# Altium schematic sheet MCU.SchDoc
size A3; CompanyName: Ok's Lab; Engineer: Oktay Topcu; SheetNumber: 3; SheetTotal: 7; UniqueID: 20200803; X2: A3; X3: 20200803; X4: r1.0; X6: 3; X7: 7; X8: MCU.SchDoc
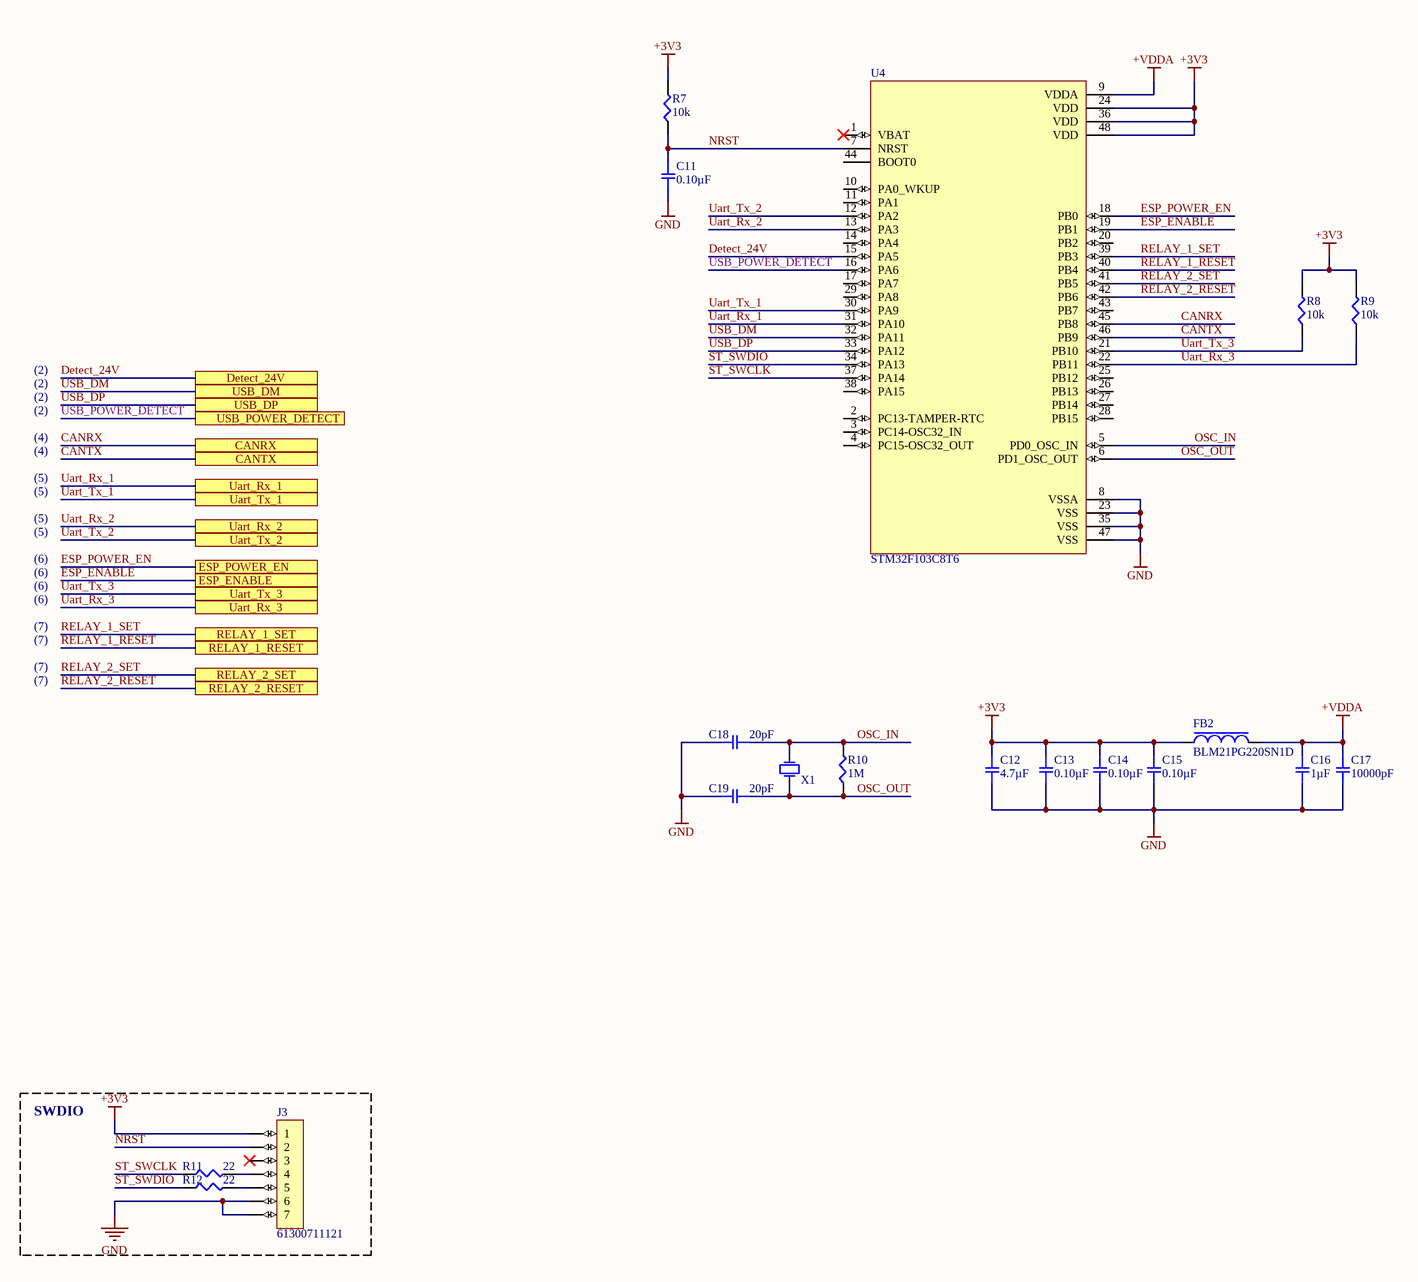
[diagram p0: MCU.SchDoc]

## Parts
C11  0.10µF  [SMD-0603C]
C12  4.7µF  [SMD-0805C]
C13  0.10µF  [SMD-0603C]
C14  0.10µF  [SMD-0603C]
C15  0.10µF  [SMD-0603C]
C16  1µF  [SMD-0603C]
C17  10000pF  [SMD-0603C]
C18  20pF  [SMD-0603C]
C19  20pF  [SMD-0603C]
FB2  BLM21PG220SN1D  [L-0805]
J3  61300711121  [HEADER_7__61300711121]
R7  10k  [SMD-0603-RES]
R8  10k  [SMD-0603-RES]
R9  10k  [SMD-0603-RES]
R10  1M  [SMD-0603-RES]
R11  22  [SMD-0603-RES]
R12  22  [SMD-0603-RES]
U4  STM32F103C8T6  [QFN48-(7mmX7mm)]
X1  EB3250AYA08-8.000M TR  [XTAL_3.2mm_1.5mm_2pad]  (value not drawn)

## Blocks framed on the sheet
SWDIO: J3 R11 R12

## Ports
CANRX, CANTX, Detect_24V, ESP_ENABLE, ESP_POWER_EN, RELAY_1_RESET, RELAY_1_SET, RELAY_2_RESET, RELAY_2_SET, Uart_Rx_1, Uart_Rx_2, Uart_Rx_3, Uart_Tx_1, Uart_Tx_2, Uart_Tx_3, USB_DM, USB_DP, USB_POWER_DETECT

## Nets
+3V3: C12.1 C13.1 C14.1 C15.1 FB2.1 J3.1 R7.2 R8.2 R9.2 U4.24(VDD) U4.36(VDD) U4.48(VDD)
+VDDA: C16.1 C17.1 FB2.2 U4.9(VDDA)
GND: C11.2 C12.2 C13.2 C14.2 C15.2 C16.2 C17.2 C18.2 C19.2 J3.6 J3.7 U4.8(VSSA) U4.23(VSS) U4.35(VSS) U4.47(VSS)
CANRX: U4.45(PB8) ; port CANRX
CANTX: U4.46(PB9) ; port CANTX
Detect_24V: U4.15(PA5) ; port Detect_24V
ESP_ENABLE: U4.19(PB1) ; port ESP_ENABLE
ESP_POWER_EN: U4.18(PB0) ; port ESP_POWER_EN
NRST: C11.1 J3.2 R7.1 U4.7(NRST)
OSC_IN: C18.1 R10.2 U4.5(PD0_OSC_IN) X1.2(OSC2)
OSC_OUT: C19.1 R10.1 U4.6(PD1_OSC_OUT) X1.1(OSC1)
RELAY_1_RESET: U4.40(PB4) ; port RELAY_1_RESET
RELAY_1_SET: U4.39(PB3) ; port RELAY_1_SET
RELAY_2_RESET: U4.42(PB6) ; port RELAY_2_RESET
RELAY_2_SET: U4.41(PB5) ; port RELAY_2_SET
ST_SWCLK: R11.1 U4.37(PA14)
ST_SWDIO: R12.1 U4.34(PA13)
Uart_Rx_1: U4.31(PA10) ; port Uart_Rx_1
Uart_Rx_2: U4.13(PA3) ; port Uart_Rx_2
Uart_Rx_3: R9.1 U4.22(PB11) ; port Uart_Rx_3
Uart_Tx_1: U4.30(PA9) ; port Uart_Tx_1
Uart_Tx_2: U4.12(PA2) ; port Uart_Tx_2
Uart_Tx_3: R8.1 U4.21(PB10) ; port Uart_Tx_3
USB_DM: U4.32(PA11) ; port USB_DM
USB_DP: U4.33(PA12) ; port USB_DP
USB_POWER_DETECT: U4.16(PA6) ; port USB_POWER_DETECT
NetJ3_4: J3.4 R11.2
NetJ3_5: J3.5 R12.2

Not connected (* = marked no-connect by the designer): J3 3*; U4 1(VBAT)* 2(PC13-TAMPER-RTC) 3(PC14-OSC32_IN) 4(PC15-OSC32_OUT) 10(PA0_WKUP) 11(PA1) 14(PA4) 17(PA7) 20(PB2) 25(PB12) 26(PB13) 27(PB14) 28(PB15) 29(PA8) 38(PA15) 43(PB7) 44(BOOT0)

## Notes on the sheet
- (2)
- (4)
- (5)
- (6)
- (7)
- Title
- Size:
- Date:
- Number:
- Revision:
- Sheet
- of
- File:

## Library data of the parts
C11 C13-C15 = GCJ188R71H104KA12D: CAP CER 0.1UF 50V X7R 0603; Manufacturer: Murata Electronics North America; Factory Stock: 0; Unit Price (USD): 0.12; Minimum Quantity: 1; Tolerance: ±10%; Datasheets: http://www.murata.com/~/media/webrenewal/support/library/catalog/products/capacitor/mlcc/c03e.ashx; Image: //media.digikey.com/Renders/Murata%20Renders/0603%28LQG18%29.jpg; Digi-Key Part Number: 490-5798-1-ND; Part Number: GCJ188R71H104KA12D; Quantity Available: 163695; @ qty: 0; Packaging: Cut Tape (CT); Series: GCJ; Part Status: Active; Value: 0.10µF; Voltage: 50V; Temperature Coefficient: X7R; Operating Temperature: -55°C ~ 125°C; Features: Soft Termination; Ratings: AEC-Q200; Applications: Automotive, Boardflex Sensitive; Mounting Type: Surface Mount, MLCC; Package / Case: 0603 (1608 Metric); Size / Dimension: 0.063" L x 0.031" W (1.60mm x 0.80mm); Height - Seated (Max): -; Thickness (Max): 0.035" (0.90mm); Lead Spacing: -; Lead Style: -
C12 = GCJ21BR71C475KA01L: CAP CER 4.7UF 16V X7R 0805; Manufacturer: Murata Electronics North America; Factory Stock: 0; Unit Price (USD): 0.44; Minimum Quantity: 1; Tolerance: ±10%; Datasheets: http://www.murata.com/~/media/webrenewal/support/library/catalog/products/capacitor/mlcc/c03e.ashx; Image: //media.digikey.com/Renders/Murata%20Renders/0805%20(2012%20Metric)%20.85mm.jpg; Digi-Key Part Number: 490-10557-1-ND; Part Number: GCJ21BR71C475KA01L; Quantity Available: 53217; @ qty: 0; Packaging: Cut Tape (CT); Series: GCJ; Part Status: Active; Value: 4.7µF; Voltage: 16V; Temperature Coefficient: X7R; Operating Temperature: -55°C ~ 125°C; Features: Soft Termination; Ratings: AEC-Q200; Applications: Automotive, Boardflex Sensitive; Mounting Type: Surface Mount, MLCC; Package / Case: 0805 (2012 Metric); Size / Dimension: 0.079" L x 0.049" W (2.00mm x 1.25mm); Height - Seated (Max): -; Thickness (Max): 0.057" (1.45mm); Lead Spacing: -; Lead Style: -
C16 = GCM188R71C105KA64D: CAP CER 1UF 16V X7R 0603; Manufacturer: Murata Electronics North America; Factory Stock: 0; Unit Price (USD): 0.24; Minimum Quantity: 1; Tolerance: ±10%; Datasheets: http://www.murata.com/~/media/webrenewal/support/library/catalog/products/capacitor/mlcc/c03e.ashx; Image: //media.digikey.com/Renders/Murata%20Renders/0603%28GCM188%29.jpg; Digi-Key Part Number: 490-5241-1-ND; Part Number: GCM188R71C105KA64D; Quantity Available: 9243; @ qty: 0; Packaging: Cut Tape (CT); Series: GCM; Part Status: Active; Value: 1µF; Voltage: 16V; Temperature Coefficient: X7R; Operating Temperature: -55°C ~ 125°C; Features: -; Ratings: AEC-Q200; Applications: Automotive; Mounting Type: Surface Mount, MLCC; Package / Case: 0603 (1608 Metric); Size / Dimension: 0.063" L x 0.031" W (1.60mm x 0.80mm); Height - Seated (Max): -; Thickness (Max): 0.035" (0.90mm); Lead Spacing: -; Lead Style: -
C17 = GRM188R71C103KA01D: CAP CER 10000PF 16V X7R 0603; Manufacturer: Murata Electronics North America; Factory Stock: 0; Unit Price (USD): 0.1; Minimum Quantity: 1; Tolerance: ±10%; Datasheets: http://www.murata.com/~/media/webrenewal/support/library/catalog/products/capacitor/mlcc/c02e.pdf; Image: //media.digikey.com/Renders/Murata%20Renders/ZRB-SERIES-0402.jpg; Digi-Key Part Number: 490-1525-1-ND; Part Number: GRM188R71C103KA01D; Quantity Available: 178769; @ qty: 0; Packaging: Cut Tape (CT); Series: GRM; Part Status: Active; Value: 10000pF; Voltage: 16V; Temperature Coefficient: X7R; Operating Temperature: -55°C ~ 125°C; Features: -; Ratings: -; Applications: General Purpose; Mounting Type: Surface Mount, MLCC; Package / Case: 0603 (1608 Metric); Size / Dimension: 0.063" L x 0.031" W (1.60mm x 0.80mm); Height - Seated (Max): -; Thickness (Max): 0.035" (0.90mm); Lead Spacing: -; Lead Style: -
C18 C19 = GCM1885C1H200JA16D: CAP CER 20PF 50V NP0 0603; Manufacturer: Murata Electronics North America; Factory Stock: 0; Unit Price (USD): 0.11; Minimum Quantity: 1; Tolerance: ±5%; Temperature Coefficient: C0G, NP0; Datasheets: http://www.murata.com/~/media/webrenewal/support/library/catalog/products/capacitor/mlcc/c03e.ashx; Image: //media.digikey.com/Renders/Murata%20Renders/0603%28GCM188%29.jpg; Digi-Key Part Number: 490-13299-1-ND; Part Number: GCM1885C1H200JA16D; Quantity Available: 4211; @ qty: 0; Packaging: Cut Tape (CT); Series: GCM; Part Status: Active; Value: 20pF; Voltage: 50V; Operating Temperature: -55°C ~ 125°C; Features: -; Ratings: AEC-Q200; Applications: Automotive; Mounting Type: Surface Mount, MLCC; Package / Case: 0603 (1608 Metric); Size / Dimension: 0.063" L x 0.031" W (1.60mm x 0.80mm); Height - Seated (Max): -; Thickness (Max): 0.035" (0.90mm); Lead Spacing: -; Lead Style: -
FB2 = Ferrite_Bead__BLM21PG220SN1D: FERRITE BEAD 22 OHM 0805 1LN; Manufacturer: Murata; Manufacturer Series: BLM21P; Material: Steel,Ferrite; Impedance: 22R; DC Resistance (DCR): 9mR; Tolerance: 25%; Current Rating: 6A; Shielding: Unshielded; Number of Circuits: 1; Resistance: 10mR; Test Frequency: 100MHz; Supplier 1: Avnet; Manufacturer Part Number: BLM21PG220SN1D; Stock 1: 0; Pricing 1: 4000=0.0273, 8000=0.0267, 16000=0.0263, 24000=0.0256, 32000=0.025 (USD); Case/Package: 0805; Number of Pins: 2; Core Material: Ferrite; Case Code (Metric): 2012; Case Code (Imperial): 0805; Weight: 0.000194oz; Terminal Finish: Tin; Min Operating Temperature: -55°C; Max Operating Temperature: 125°C; Packaging: Tape and Reel; Max DC Current: 6A; Number of Lines: 1; Series: BLM21P; Package Quantity: 1; Max Current Rating: 6A; Termination: SMD/SMT; DC Current: 6A; DC Resistance-Max: 9mR; Number of Functions: 1; Length: 2mm; Width: 1.25mm; Height: 0.85mm; Depth: 1.25mm; Radiation Hardening: No; REACH SVHC: No SVHC; Lead Free: Lead Free; RoHS Compliant: Yes; ComponentLink1URL: http://www.murata.com/products/catalog/pdf/c31e.pdf?src-supplier=Element14; ComponentLink1Description: http://www.murata.com/products/catalog/pdf/c31e.pdf?src-supplier=Element14; ComponentLink2URL: http://www.murata.com/products/catalog/pdf/c31e.pdf?src-supplier=Distrelec; ComponentLink2Description: http://www.murata.com/products/catalog/pdf/c31e.pdf?src-supplier=Distrelec; ComponentLink3URL: http://www.jameco.com/Jameco/Products/ProdDS/1845312.pdf?src-supplier=Jameco; ComponentLink3Description: http://www.jameco.com/Jameco/Products/ProdDS/1845312.pdf?src-supplier=Jameco; ComponentLink4URL: https://www.murata.com/en-us/products/productdata/8796738977822/ENFA0005.pdf?src-supplier=Digi-Key; ComponentLink4Description: https://www.murata.com/en-us/products/productdata/8796738977822/ENFA0005.pdf?src-supplier=Digi-Key; ComponentLink5URL: http://uk.rs-online.com/webdocs/13ec/0900766b813ecf58.pdf?src-supplier=RSComponents; ComponentLink5Description: http://uk.rs-online.com/webdocs/13ec/0900766b813ecf58.pdf?src-supplier=RSComponents; ComponentLink6URL: http://www.murata.com/products/catalog/pdf/c31e.pdf?src-supplier=Avnet; ComponentLink6Description: http://www.murata.com/products/catalog/pdf/c31e.pdf?src-supplier=Avnet; ComponentLink7URL: http://search.murata.co.jp/Ceramy/image/img/PDF/ENG/L0110S0100BLM21P.pdf?src-supplier=Future+Electronics; ComponentLink7Description: http://search.murata.co.jp/Ceramy/image/img/PDF/ENG/L0110S0100BLM21P.pdf?src-supplier=Future+Electronics; ComponentLink8URL: http://www.produktinfo.conrad.com/datenblaetter/1100000-1199999/001171738-da-01-en-CHIP_DROSSEL0805_22R0_6000MA_2_0X1_25MM.pdf?src-supplier=Conrad; ComponentLink8Description: http://www.produktinfo.conrad.com/datenblaetter/1100000-1199999/001171738-da-01-en-CHIP_DROSSEL0805_22R0_6000MA_2_0X1_25MM.pdf?src-supplier=Conrad; Supplier Part Number 1: BLM21PG220SN1D
J3 = HEADER_7__61300711121: CONN HEADER 7 POS 2.54; Manufacturer: Wurth Electronics Inc.; Current Rating: 3A; Voltage Rating: 250V; Material Flammability Rating: UL94 V-0; Style: Board to Board or Cable; Number of Positions Loaded: All; Overall Contact Length: 0.454" (11.54mm); Number of Positions: 7; Contact Length - Mating: 0.236" (6.00mm); Contact Length - Post: 0.118" (3.00mm); Shrouding: Unshrouded; Pitch - Mating: 0.100" (2.54mm); Contact Shape: Square; Insulation Height: 0.100" (2.54mm); Insulation Color: Black; Contact Finish Thickness - Mating: -; Operating Temperature: -40°C ~ 125°C; Contact Material: Copper Alloy; Features: -; Ingress Protection: -; Contact Finish - Post: -; Mated Stacking Heights: -; Contact Finish - Mating: Gold; Applications: -; Contact Finish Thickness - Post: -; Insulation Material: Polybutylene Terephthalate (PBT); Manufacturer Part Number: 61300711121; Fastening Type: Push-Pull; Supplier: Digi-Key; Category: Connectors, Interconnects; Mounting Type: Through Hole; Row Spacing - Mating: -; Connector Type: Header; Number of Rows: 1; Termination: Solder; RoHS: RoHS Compliant; Packaging: Bulk; Contact Type: Male Pin; Part Status: Active; ComponentLink1URL: http://katalog.we-online.de/em/datasheet/6130xx11121.pdf; ComponentLink1Description: http://katalog.we-online.de/em/datasheet/6130xx11121.pdf; Pricing: 1=0.37, 10=0.315, 25=0.2632, 50=0.219, 100=0.199, 1000=0.181 (USD); Supplier Part Number: 732-5320-ND
R7 = ERJ-3GEYJ103V: RES SMD 10K OHM 5% 1/10W 0603; Manufacturer: Panasonic Electronic Components; Factory Stock: 0; Unit Price (USD): 0.00321; @ qty: 1500; Minimum Quantity: 1; Power (Watts): 0.1W, 1/10W; Temperature Coefficient: ±200ppm/°C; Part Number: ERJ-3GEYJ103V; Datasheets: http://industrial.panasonic.com/www-cgi/jvcr13pz.cgi?E+PZ+3+AOA0001+ERJ3GEYJ103V+7+WW; Image: //media.digikey.com/Photos/Panasonic%20Photos/MFG_ERJ-P6W%20Series.jpg; Digi-Key Part Number: P10KGCT-ND; Quantity Available: 7178118; Packaging: Cut Tape (CT); Series: ERJ; Part Status: Active; Value: 10k; Tolerance: ±5%; Composition: Thick Film; Features: Automotive AEC-Q200; Operating Temperature: -55°C ~ 155°C; Package / Case: 0603 (1608 Metric); Supplier Device Package: 0603; Size / Dimension: 0.063" L x 0.031" W (1.60mm x 0.80mm); Height - Seated (Max): 0.022" (0.55mm); Number of Terminations: 2; Failure Rate: -
R8 R9 = ERJ-3EKF1002V: RES SMD 10K OHM 1% 1/10W 0603; Manufacturer: Panasonic Electronic Components; Factory Stock: 0; Unit Price (USD): 0.00379; @ qty: 1500; Minimum Quantity: 1; Power (Watts): 0.1W, 1/10W; Temperature Coefficient: ±100ppm/°C; Part Number: ERJ-3EKF1002V; Datasheets: http://industrial.panasonic.com/www-cgi/jvcr13pz.cgi?E+PZ+3+AOA0002+ERJ3EKF1002V+7+WW; Image: //media.digikey.com/Photos/Panasonic%20Photos/MFG_ERJ-P6W%20Series.jpg; Digi-Key Part Number: P10.0KHCT-ND; Quantity Available: 6703141; Packaging: Cut Tape (CT); Series: ERJ; Part Status: Active; Value: 10k; Tolerance: ±1%; Composition: Thick Film; Features: Automotive AEC-Q200; Operating Temperature: -55°C ~ 155°C; Package / Case: 0603 (1608 Metric); Supplier Device Package: 0603; Size / Dimension: 0.063" L x 0.031" W (1.60mm x 0.80mm); Height - Seated (Max): 0.022" (0.55mm); Number of Terminations: 2; Failure Rate: -
R10 = ERJ-3GEYJ105V: RES SMD 1M OHM 5% 1/10W 0603; Manufacturer: Panasonic Electronic Components; Factory Stock: 0; Unit Price (USD): 0.00321; @ qty: 1500; Minimum Quantity: 1; Power (Watts): 0.1W, 1/10W; Temperature Coefficient: ±200ppm/°C; Part Number: ERJ-3GEYJ105V; Datasheets: http://industrial.panasonic.com/www-cgi/jvcr13pz.cgi?E+PZ+3+AOA0001+ERJ3GEYJ105V+7+WW; Image: //media.digikey.com/Photos/Panasonic%20Photos/MFG_ERJ-P6W%20Series.jpg; Digi-Key Part Number: P1.0MGCT-ND; Quantity Available: 250051; Packaging: Cut Tape (CT); Series: ERJ; Part Status: Active; Value: 1M; Tolerance: ±5%; Composition: Thick Film; Features: Automotive AEC-Q200; Operating Temperature: -55°C ~ 155°C; Package / Case: 0603 (1608 Metric); Supplier Device Package: 0603; Size / Dimension: 0.063" L x 0.031" W (1.60mm x 0.80mm); Height - Seated (Max): 0.022" (0.55mm); Number of Terminations: 2; Failure Rate: -
R11 R12 = ERJ-3EKF22R0V: RES SMD 22 OHM 1% 1/10W 0603; Manufacturer: Panasonic Electronic Components; Factory Stock: 0; Unit Price (USD): 0.00379; @ qty: 1500; Minimum Quantity: 1; Power (Watts): 0.1W, 1/10W; Temperature Coefficient: ±100ppm/°C; Part Number: ERJ-3EKF22R0V; Datasheets: http://industrial.panasonic.com/www-cgi/jvcr13pz.cgi?E+PZ+3+AOA0002+ERJ3EKF22R0V+7+WW; Image: //media.digikey.com/Photos/Panasonic%20Photos/MFG_ERJ-P6W%20Series.jpg; Digi-Key Part Number: P22.0HCT-ND; Quantity Available: 100321; Packaging: Cut Tape (CT); Series: ERJ; Part Status: Active; Value: 22; Tolerance: ±1%; Composition: Thick Film; Features: Automotive AEC-Q200; Operating Temperature: -55°C ~ 155°C; Package / Case: 0603 (1608 Metric); Supplier Device Package: 0603; Size / Dimension: 0.063" L x 0.031" W (1.60mm x 0.80mm); Height - Seated (Max): 0.022" (0.55mm); Number of Terminations: 2; Failure Rate: -
U4 = STM32F103C8T6: IC MCU 32-Bit 72MHz 64kB FLASH LQFP48; MF: STMicroelectronics; RAM Size: 20KB; Max Power Dissipation: 363mW; Interface: I2C,SPI,USB,CAN,IrDA,UART,USART,LIN; Number of I/Os: 37; Number of Timers/Counters: 4; Max Supply Voltage: 3.6V; Number of ADC Channels: 10; Min Supply Voltage: 2V; Oscillator Type: Internal; Number of Programmable I/O: 48; Data Bus Width: 32b; Number of Bits: 32; Watchdog Timer: Yes; Peripherals: POR,PWM,WDT,DMA,Temp Sensor,I2C; Core Architecture: ARM; Number of PWM Channels: 1; Number of SPI Channels: 2; Price: None; Package: LQFP-48 STMicroelectronics; Value: *; MP: STM32F103C8T6; Availability: Unavailable; Supplier 1: Digi-Key; Manufacturer: STMicroelectronics; Manufacturer Part Number: STM32F103C8T6; RoHS: Yes; Category: Microcontrollers; Pricing 1: 1=7,00000, 10=6,28800, 25=5,94440, 80=5,15175, 250=4,88756, 500=4,40320 (USD); Case/Package: LQFP; Number of Pins: 48; Min Operating Temperature: -40°C; Max Operating Temperature: 85°C; Frequency: 72MHz; Packaging: Tray; Package Quantity: 250; Density: 64KB; Memory Type: FLASH; Max Frequency: 72MHz; Memory Size: 64KB; Termination: SMD/SMT; Number of I2C Channels: 2; Address Bus Width: 32b; Length: 7mm; Width: 7.2mm; Height: 1.45mm; Radiation Hardening: No; Lead Free: Lead Free; REACH SVHC: No SVHC; ComponentLink1URL: https://datasheet.ciiva.com/15122/getdatasheetpartid-69880-15122076.pdf?src-supplier=Verical; ComponentLink1Description: https://datasheet.ciiva.com/15122/getdatasheetpartid-69880-15122076.pdf?src-supplier=Verical; ComponentLink2URL: https://datasheet.ciiva.com/26816/stm32f103c8t6-26816902.pdf?src-supplier=IIIC; ComponentLink2Description: https://datasheet.ciiva.com/26816/stm32f103c8t6-26816902.pdf?src-supplier=IIIC; ComponentLink3URL: https://datasheet.ciiva.com/16210/cd00161566-16210248.pdf?src-supplier=Future+Electronics; ComponentLink3Description: https://datasheet.ciiva.com/16210/cd00161566-16210248.pdf?src-supplier=Future+Electronics; ComponentLink4URL: https://datasheet.ciiva.com/14100/pustm-arm-microcont-stm32f103-en-14100508.pdf?src-supplier=Distrelec; ComponentLink4Description: https://datasheet.ciiva.com/14100/pustm-arm-microcont-stm32f103-en-14100508.pdf?src-supplier=Distrelec; ComponentLink5URL: https://datasheet.ciiva.com/8054/1730126-8054942.pdf?src-supplier=Element14; ComponentLink5Description: https://datasheet.ciiva.com/8054/1730126-8054942.pdf?src-supplier=Element14; ComponentLink6URL: https://datasheet.ciiva.com/48687/001075658-da-01-en-mcu-64kb-mem-stm32f103c8t6-lqfp-48-stm-48687589.pdf?src-supplier=Conrad; ComponentLink6Description: https://datasheet.ciiva.com/48687/001075658-da-01-en-mcu-64kb-mem-stm32f103c8t6-lqfp-48-stm-48687589.pdf?src-supplier=Conrad; Supplier Part Number 1: 497-6063-ND
X1 = CRYSTAL__ECS-.327-12.5-34B-TR: Crystal 8MHz 8pF Automotive 2-Pin CSMD T/R; Manufacturer: Ecliptek; Supplier 1: Digi-Key; Supplier Part Number 1: 2773-EB3250AYA08-8.000MCT-ND; Manufacturer Part Number: EB3250AYA08-8.000M TR; RoHS: Yes; Stock 1: 16756; Pricing 1: 1=1,05000, 10=0,92900, 50=0,86860, 100=0,76760, 500=0,72720 (USD); RoHS Compliant: No